# EAGLE design deter-board (EAGLE 9.6.2)
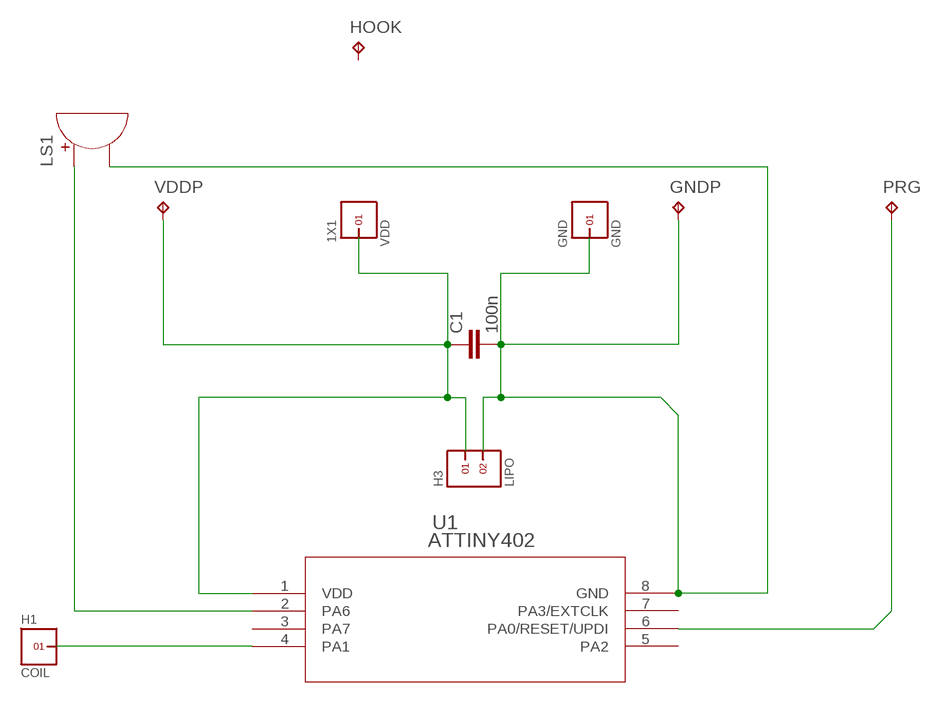
[diagram p0: schematic, sheet 1]

## Parts
C1  100n  CAP-1206  [1206]
GND  GND  1X1  [1X1]
GNDP  GND  TPB1,27  [B1,27]
H1  COIL  1X1  [1X1]
H3  LIPO  1X2  [1X2]
HOOK  HOOK  TPPAD1-17Y  [P1-17Y]
LS1  BUZZER_(9650)  [S-BUZZER-MLT-9650]
PRG  PROG  TPB2,54  [B2,54]
U1  ATTINY402  ATTINY402-SSN  [SOIC8_4P9X3P9MC_MCH]
VDD  1X1  [1X1]
VDDP  VDD  TPB1,27  [B1,27]

## Nets
N$1: LS1.P$2(+) U1.2(PA6)
N$2: C1.1 H3.1 U1.1(VDD) VDD.1 VDDP.TP
N$3: C1.2 GND.1 GNDP.TP H3.2 LS1.P$1(-) U1.8(GND)
N$4: PRG.TP U1.6(PA0/RESET/UPDI)
N$5: H1.1 U1.4(PA1)
Unconnected: HOOK.TP U1.3(PA7) U1.5(PA2) U1.7(PA3/EXTCLK)

## Library data of the parts
C1 = SparkFun-Capacitors:CAP
GND H1 VDD = headers(.1in):1X1
GNDP HOOK PRG VDDP = testpad:TP: Test pad
H3 = headers(.1in):1X2
LS1 = Others:BUZZER: Piezo Buzzer Created by: Wai Weng; CYTRON-PC: S-BUZZ-MLT-9650; DESC: SMD Buzzer MLT9650; MPN: MLT-9650
U1 = attiny402:ATTINY402-SSN; COPYRIGHT: Copyright (C) 2024 Ultra Librarian. All rights reserved.; MANUFACTURER_PART_NUMBER: ATTINY402-SSN; MFR_NAME: Microchip

## Net classes
0 default: clearance 0.205 mm

## Board
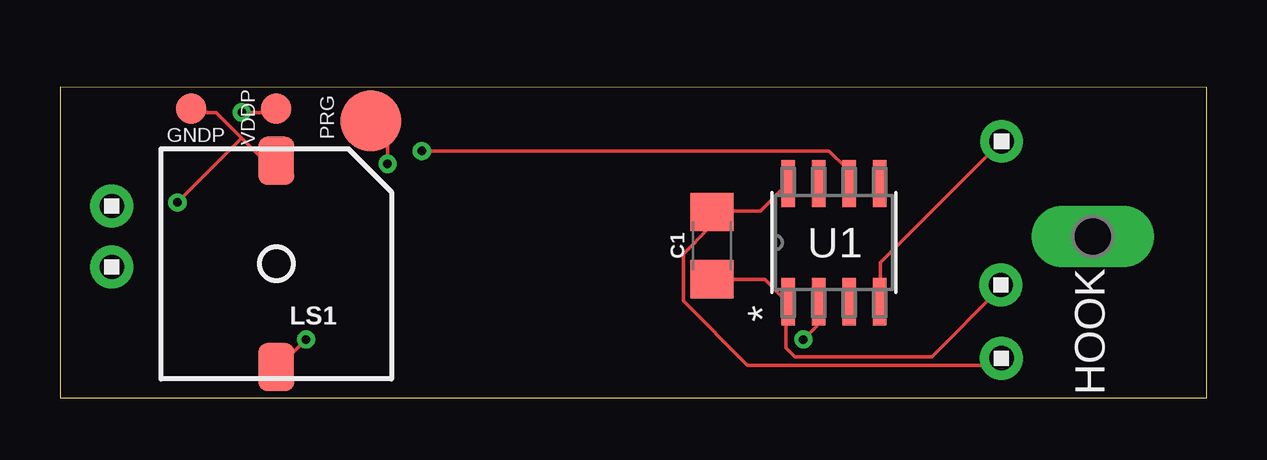
[diagram p1: board, top side]
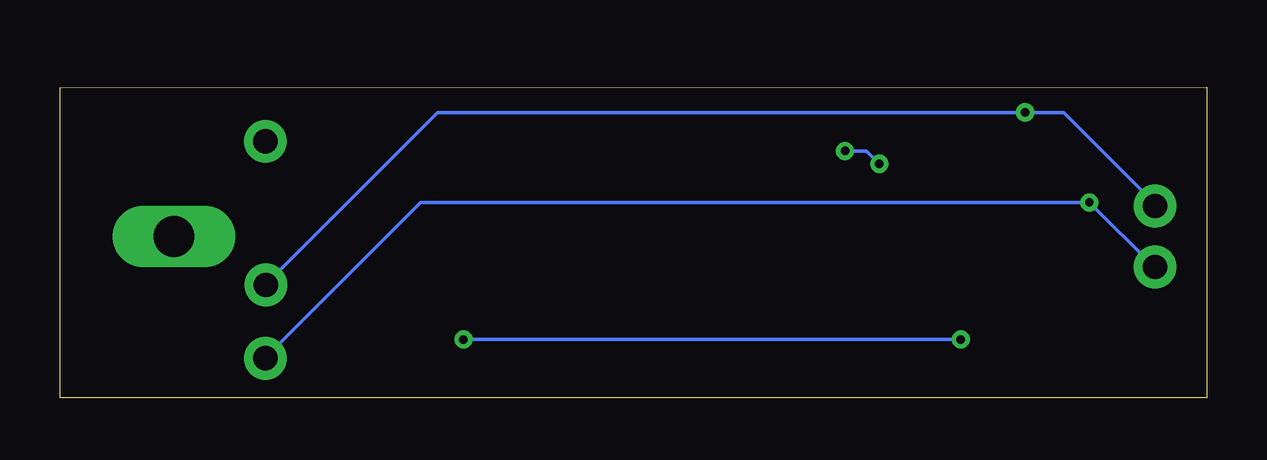
[diagram p2: board, bottom side, seen from below]

Size 47.8 x 12.95 mm. Coordinates in mm from the lower left corner, seen from the top.
Outline: 0,0 47.8,0 47.8,12.94 0.01,12.95 0,0
Copper layers (1*16): Top 0.035mm / dielectric 1.5mm / Bottom 0.035mm
Design rules "default": minimum track width 6mil, minimum drill 0.35mm, track to track 6mil, track to pad 6mil, pad to pad 6mil, via to via 6mil, smd to smd 6mil, copper to edge 40mil, drill to drill 6mil, minimum pad ring 10mil, minimum via ring 8mil, stop-mask expansion 4mil, vias tented up to drill 0mil, thermal gap 10mil

### Footprints (pad centres in the part's own frame; a part is rotated, then mirrored left to right if it is on the bottom)
1206 = smd 1.6 x 1.8: 1 -1.4,0; 2 1.4,0
1X1 = drill 1.016 pad 1.778: 1 0,0
B1,27 = smd 1.27 x 1.27: TP 0,0
1X2 = drill 1.016 pad 1.778: 1 0,0; 2 2.54,0
P1-17Y = drill 1.702 pad 2.121 long: TP 0,0
S-BUZZER-MLT-9650 = smd 1.5 x 2: P$1 0,-4.3; P$2 0,4.3
B2,54 = smd 2.54 x 2.54: TP 0,0
SOIC8_4P9X3P9MC_MCH = smd 1.97 x 0.558: 1 -2.464,1.905; 2 -2.464,0.635; 3 -2.464,-0.635; 4 -2.464,-1.905; 5 2.464,-1.905; 6 2.464,-0.635; 7 2.464,0.635; 8 2.464,1.905

### Placement (x,y rotation side)
C1  27.18,6.35 90 top
GND  39.24,1.65 0 top
GNDP  5.46,12.06 0 top
H1  39.25,10.7 0 top
H3  2.16,8 270 top
HOOK  43.05,6.73 90 top
LS1  9.02,5.59 180 top
PRG  12.95,11.56 0 top
U1  32.26,6.48 90 top
VDD  39.22,4.71 0 top
VDDP  9.02,12.06 0 top

### Tracks (layer width: path | path; a pad name or v marks a point on that pad's centre or on a via)
N$1  (via drill 0.35)
  Top 0.152: v30.98,2.44 31.52,2.97 31.52,3.87 U1.2 | v10.26,2.44 9.18,1.36 LS1.P$2
  Bottom 0.152: v10.26,2.44 v30.98,2.44
N$2  (via drill 0.35)
  Top 0.152: v7.57,11.91 9,11.91 VDDP.TP | C1.1 27.23,4.94 29.38,4.94 30.27,4.04 U1.1 30.27,3.87 30.27,2.08 30.63,1.72 36.35,1.72 39.2,4.58 VDD.1
  Bottom 0.152: H3.1 2.21,8.15 5.97,11.91 v7.57,11.91 32.06,11.91 39.2,4.76 VDD.1
N$3  (via drill 0.35)
  Top 0.152: 7.57,10.83 8.47,9.94 9,9.94 LS1.P$1 | 7.57,10.83 6.5,11.91 5.61,11.91 GNDP.TP | v4.89,8.15 7.57,10.83 | U1.8 30.27,8.87 29.2,7.8 27.23,7.8 C1.2 27.05,7.62 27.05,7.08 25.98,6.01 25.98,4.04 28.66,1.36 39.03,1.36 39.2,1.54 GND.1
  Bottom 0.152: H3.2 2.21,5.47 v4.89,8.15 32.77,8.15 39.2,1.72 GND.1
N$4  (via drill 0.35)
  Top 0.152: v15.08,10.3 32.06,10.3 32.77,9.58 32.77,9.05 U1.6 | v13.65,9.76 13.65,11.01 13.11,11.55 PRG.TP
  Bottom 0.152: v15.08,10.3 14.19,10.3 v13.65,9.76
N$5
  Top 0.152: U1.4 34.2,4.04 34.2,5.65 39.2,10.66 H1.1